# EasyEDA Pro project ProProject_keyboard_Tassel43_2024-03-30.epro, schematic 主控
Create Date: 2023-07-09; Page Name: 主控; Project Name: keyboard_Tassel43; Schematic Name: 主控; Update Date: 2023-07-09; Company: 嘉立创EDA; Page Size: A4; Version: V1.0
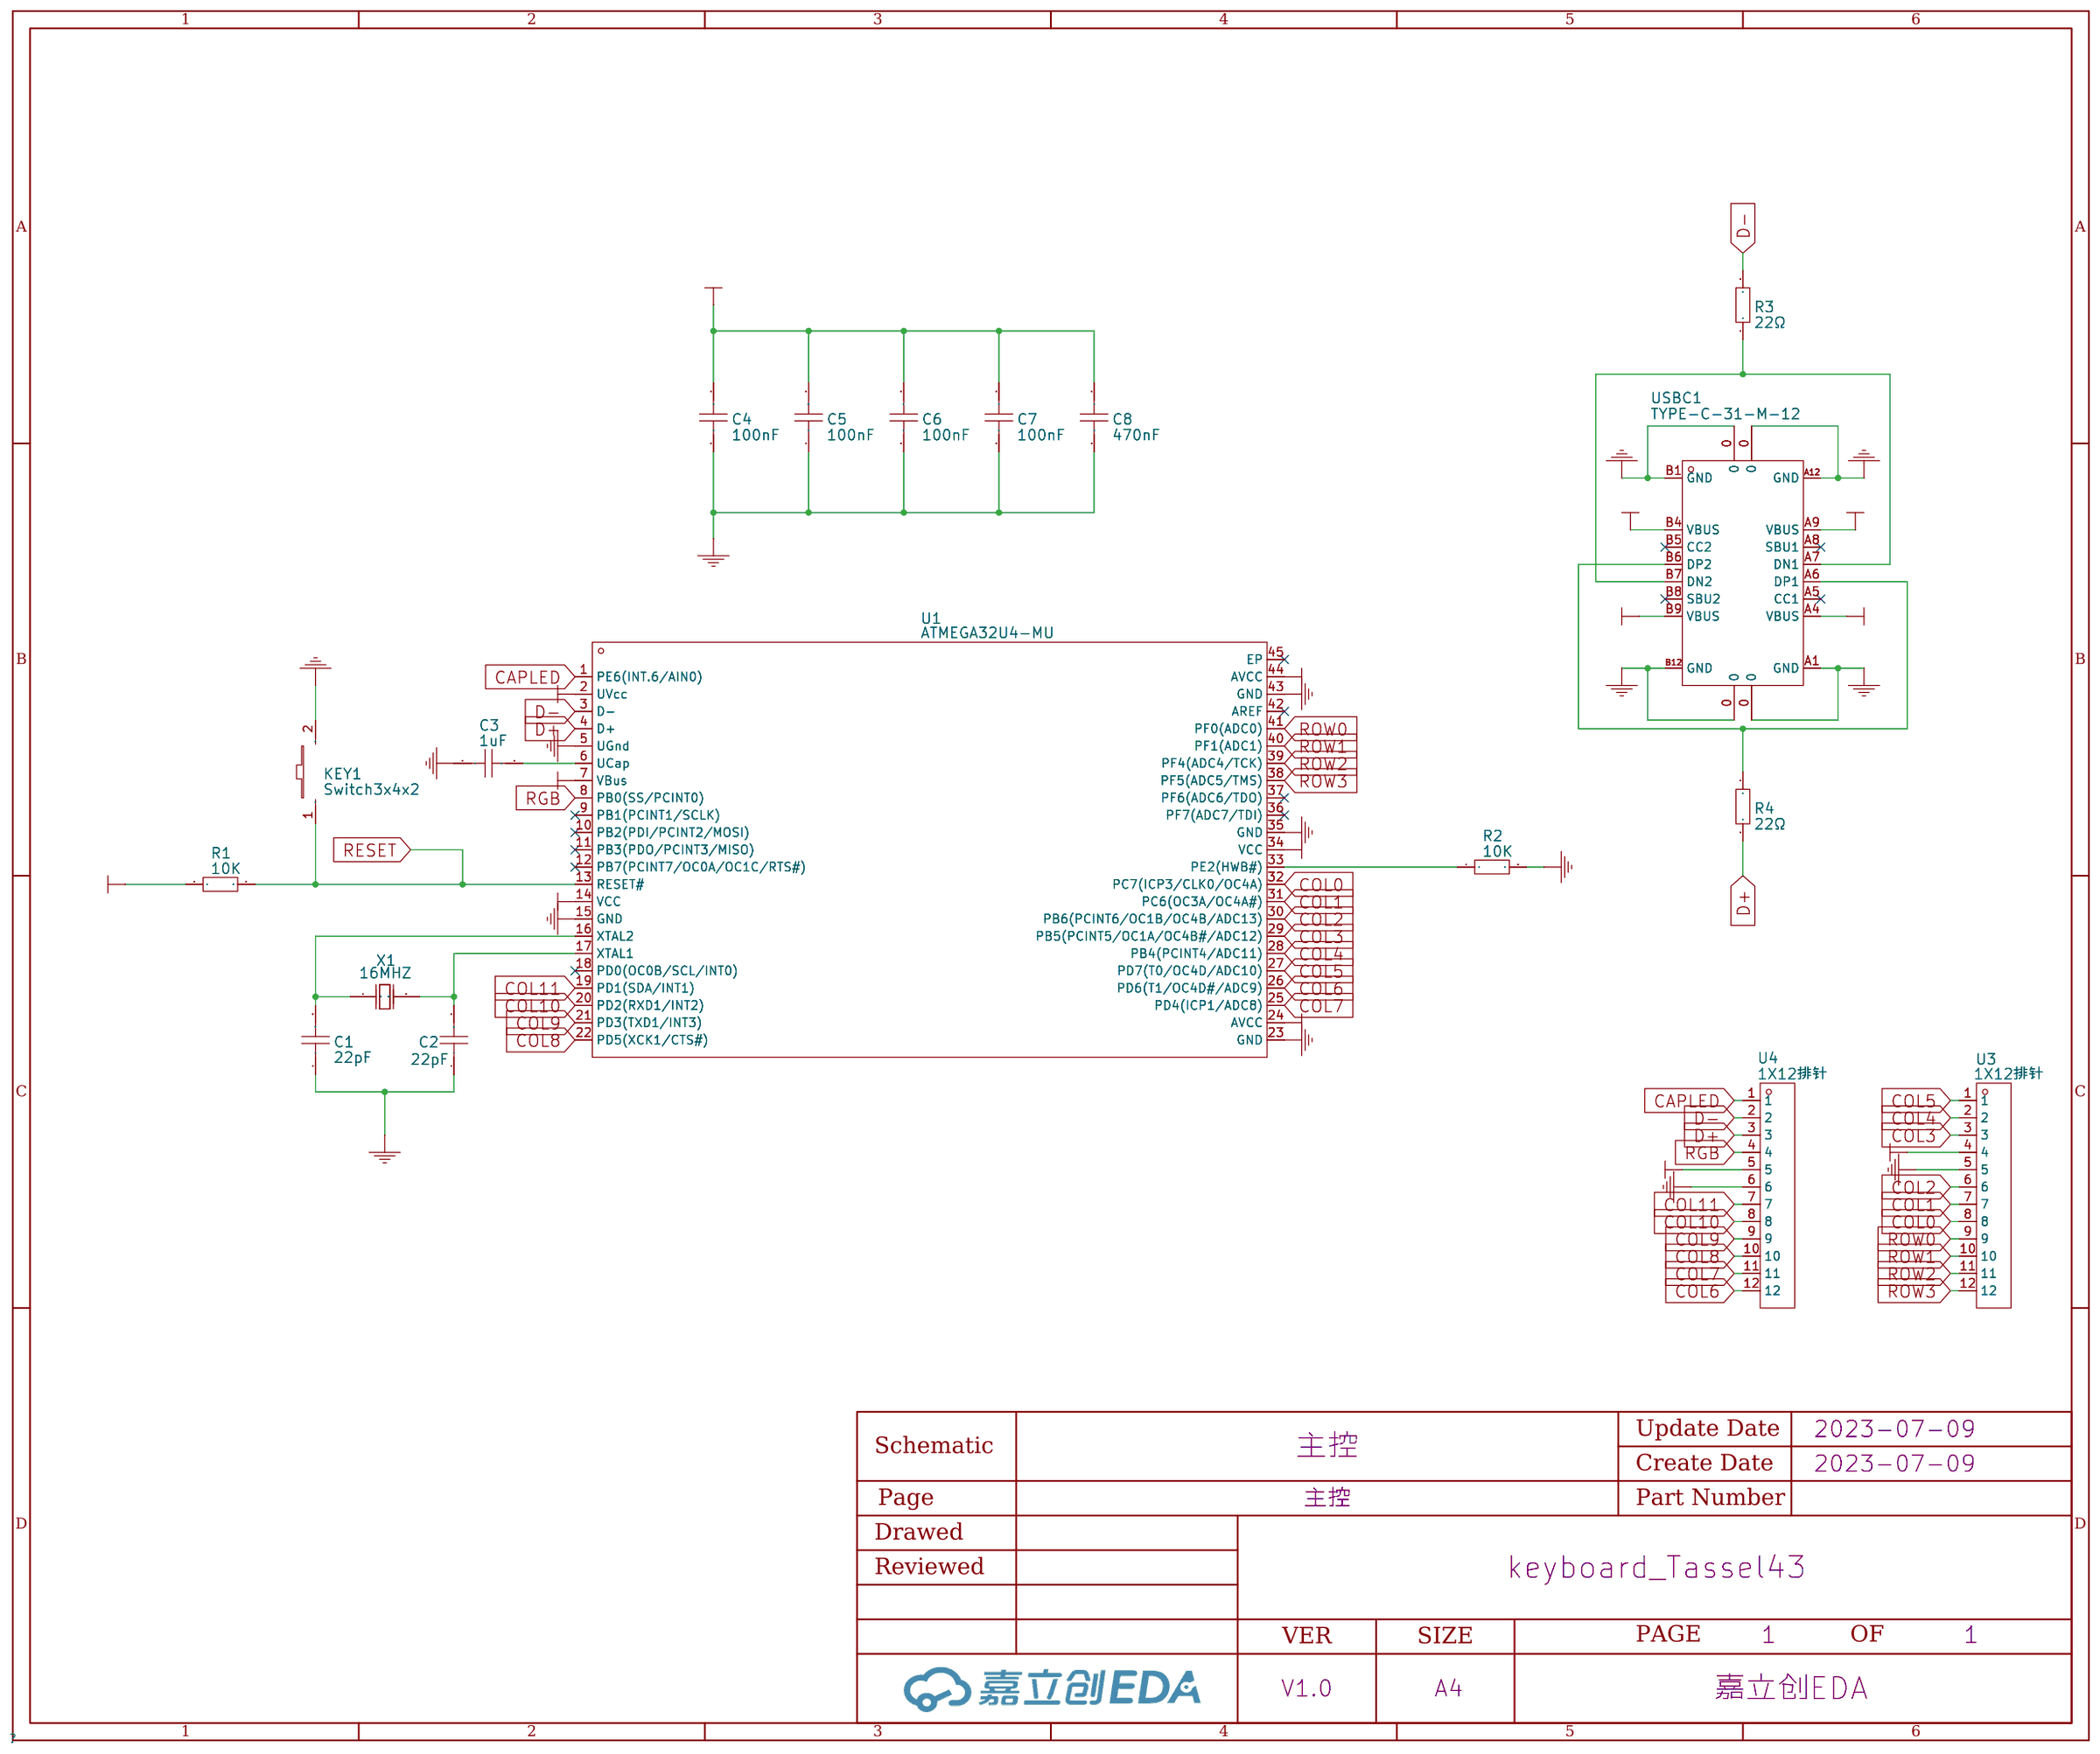
[diagram p2: schematic sheet]

## Parts
C1  22pF  [C0603]
C2  22pF  [C0603]
C3  1uF  [C0603]
C4  100nF  [C0603]
C5  100nF  [C0603]
C6  100nF  [C0603]
C7  100nF  [C0603]
C8  470nF  [C0603]
KEY1  Switch3x4x2  [SW-SMD_L4.0-W2.9-LS5.0]
R1  10K  [R0603]
R2  10K  [R0603]
R3  22Ω  [R0603]
R4  22Ω  [R0603]
U1  ATMEGA32U4-MU  [VQFN-44_L7.0-W7.0-P0.50-BL-EP5.2]
U3  1X12排针  [1X12排针]
U4  1X12排针  [1X12排针]
USBC1  TYPE-C-31-M-12  [USB-C_SMD-TYPE-C-31-M-12]
X1  16MHZ  [OSC-SMD_2P-L5.0-W3.2]

## Library data of the parts
C1 C2 = 0603N220F101CT: Supplier: LCSC; Supplier Part: C296053; Manufacturer: Huaxin ST; JLCPCB Part Class: Extended Part
C3 = 0603B105K500NT: Supplier: LCSC; Manufacturer: FH; Supplier Part: C90540; JLCPCB Part Class: Extended Part
C4-C7 = 0603B104J500NT: Supplier: LCSC; Manufacturer: FH; Supplier Part: C88136; JLCPCB Part Class: Extended Part
C8 = 0603B474K250NT: Supplier: LCSC; Manufacturer: FH; Supplier Part: C172758; JLCPCB Part Class: Extended Part
KEY1 = Switch3x4x2: Supplier: LCSC; Manufacturer: ReliaPro; Supplier Part: C26638; JLCPCB Part Class: Extended Part
R1 R2 = AC0603FR-0710KL: Supplier: LCSC; Manufacturer: YAGEO; Supplier Part: C116677; JLCPCB Part Class: Extended Part; Resistance: 10kΩ
R3 R4 = CR0603JA0220G: Supplier: LCSC; Manufacturer: LIZ; Supplier Part: C101302; Resistance: 22; JLCPCB Part Class: Extended Part
U1 = ATMEGA32U4-MU: Supplier: LCSC; Manufacturer: MICROCHIP; Supplier Part: C112161; JLCPCB Part Class: Extended Part
U3 U4 = 1X12排针
USBC1 = TYPE-C-31-M-12: Supplier: LCSC; Supplier Part: C165948; Manufacturer: Rectangular Connectors - Contacts; JLCPCB Part Class: Extended Part
X1 = XSHEELNANF-16MHZ: Supplier: LCSC; Supplier Part: C242221; Manufacturer: TAITIEN Elec; JLCPCB Part Class: Extended Part

## Nets
GND: C1.1 C2.1 C3.1 C4.1 C5.1 C6.1 C7.1 C8.2 KEY1.2 R2.2 U1.5(UGnd) U1.15(GND) U1.23(GND) U1.35(GND) U1.43(GND) U3.5 U4.6 USBC1.0 USBC1.A1(GND) USBC1.A12(GND) USBC1.B1(GND) USBC1.B12(GND)
VCC: C4.2 C5.2 C6.2 C7.2 C8.1 R1.1 U1.2(UVcc) U1.7(VBus) U1.14(VCC) U1.24(AVCC) U1.34(VCC) U1.44(AVCC) U3.4 U4.5 USBC1.A4(VBUS) USBC1.A9(VBUS) USBC1.B4(VBUS) USBC1.B9(VBUS)
CAPLED: U1.1(PE6(INT.6/AIN0)) U4.1
COL0: U1.32(PC7(ICP3/CLK0/OC4A)) U3.8
COL1: U1.31(PC6(OC3A/OC4A#)) U3.7
COL2: U1.30(PB6(PCINT6/OC1B/OC4B/ADC13)) U3.6
COL3: U1.29(PB5(PCINT5/OC1A/OC4B#/ADC12)) U3.3
COL4: U1.28(PB4(PCINT4/ADC11)) U3.2
COL5: U1.27(PD7(T0/OC4D/ADC10)) U3.1
COL6: U1.26(PD6(T1/OC4D#/ADC9)) U4.12
COL7: U1.25(PD4(ICP1/ADC8)) U4.11
COL8: U1.22(PD5(XCK1/CTS#)) U4.10
COL9: U1.21(PD3(TXD1/INT3)) U4.9
COL10: U1.20(PD2(RXD1/INT2)) U4.8
COL11: U1.19(PD1(SDA/INT1)) U4.7
D+: R4.1 U1.4(D+) U4.3
D-: R3.2 U1.3(D-) U4.2
RESET: KEY1.1 R1.2 U1.13(RESET#)
RGB: U1.8(PB0(SS/PCINT0)) U4.4
ROW0: U1.41(PF0(ADC0)) U3.9
ROW1: U1.40(PF1(ADC1)) U3.10
ROW2: U1.39(PF4(ADC4/TCK)) U3.11
ROW3: U1.38(PF5(ADC5/TMS)) U3.12
Net-(C3-2): C3.2 U1.6(UCap)
Net-(R3-1): R3.1 USBC1.A7(DN1) USBC1.B7(DN2)
Net-(R4-2): R4.2 USBC1.A6(DP1) USBC1.B6(DP2)
U1_16: C1.2 U1.16(XTAL2) X1.1(OSC1)
U1_17: C2.2 U1.17(XTAL1) X1.2(OSC2)
U1_33: R2.1 U1.33(PE2(HWB#))

Not connected (* = marked no-connect by the designer): U1 9(PB1(PCINT1/SCLK))* 10(PB2(PDI/PCINT2/MOSI))* 11(PB3(PDO/PCINT3/MISO))* 12(PB7(PCINT7/OC0A/OC1C/RTS#))* 18(PD0(OC0B/SCL/INT0))* 36(PF7(ADC7/TDI))* 37(PF6(ADC6/TDO))* 42(AREF)* 45(EP)*; USBC1 A5(CC1)* A8(SBU1)* B5(CC2)* B8(SBU2)*
